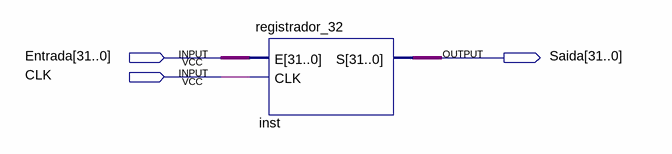
[diagram p0: schematic sheet]
// Quartus schematic PC.bdf as structural Verilog: 1 symbols, 3 pins
module PC (
  input  [31:0] Entrada,
  input  CLK,
  output [31:0] Saida
);

  registrador_32 inst (.E(Entrada), .CLK(CLK), .S(Saida));
endmodule
